# EAGLE design BPMLabLineRX (EAGLE 7.5.0)
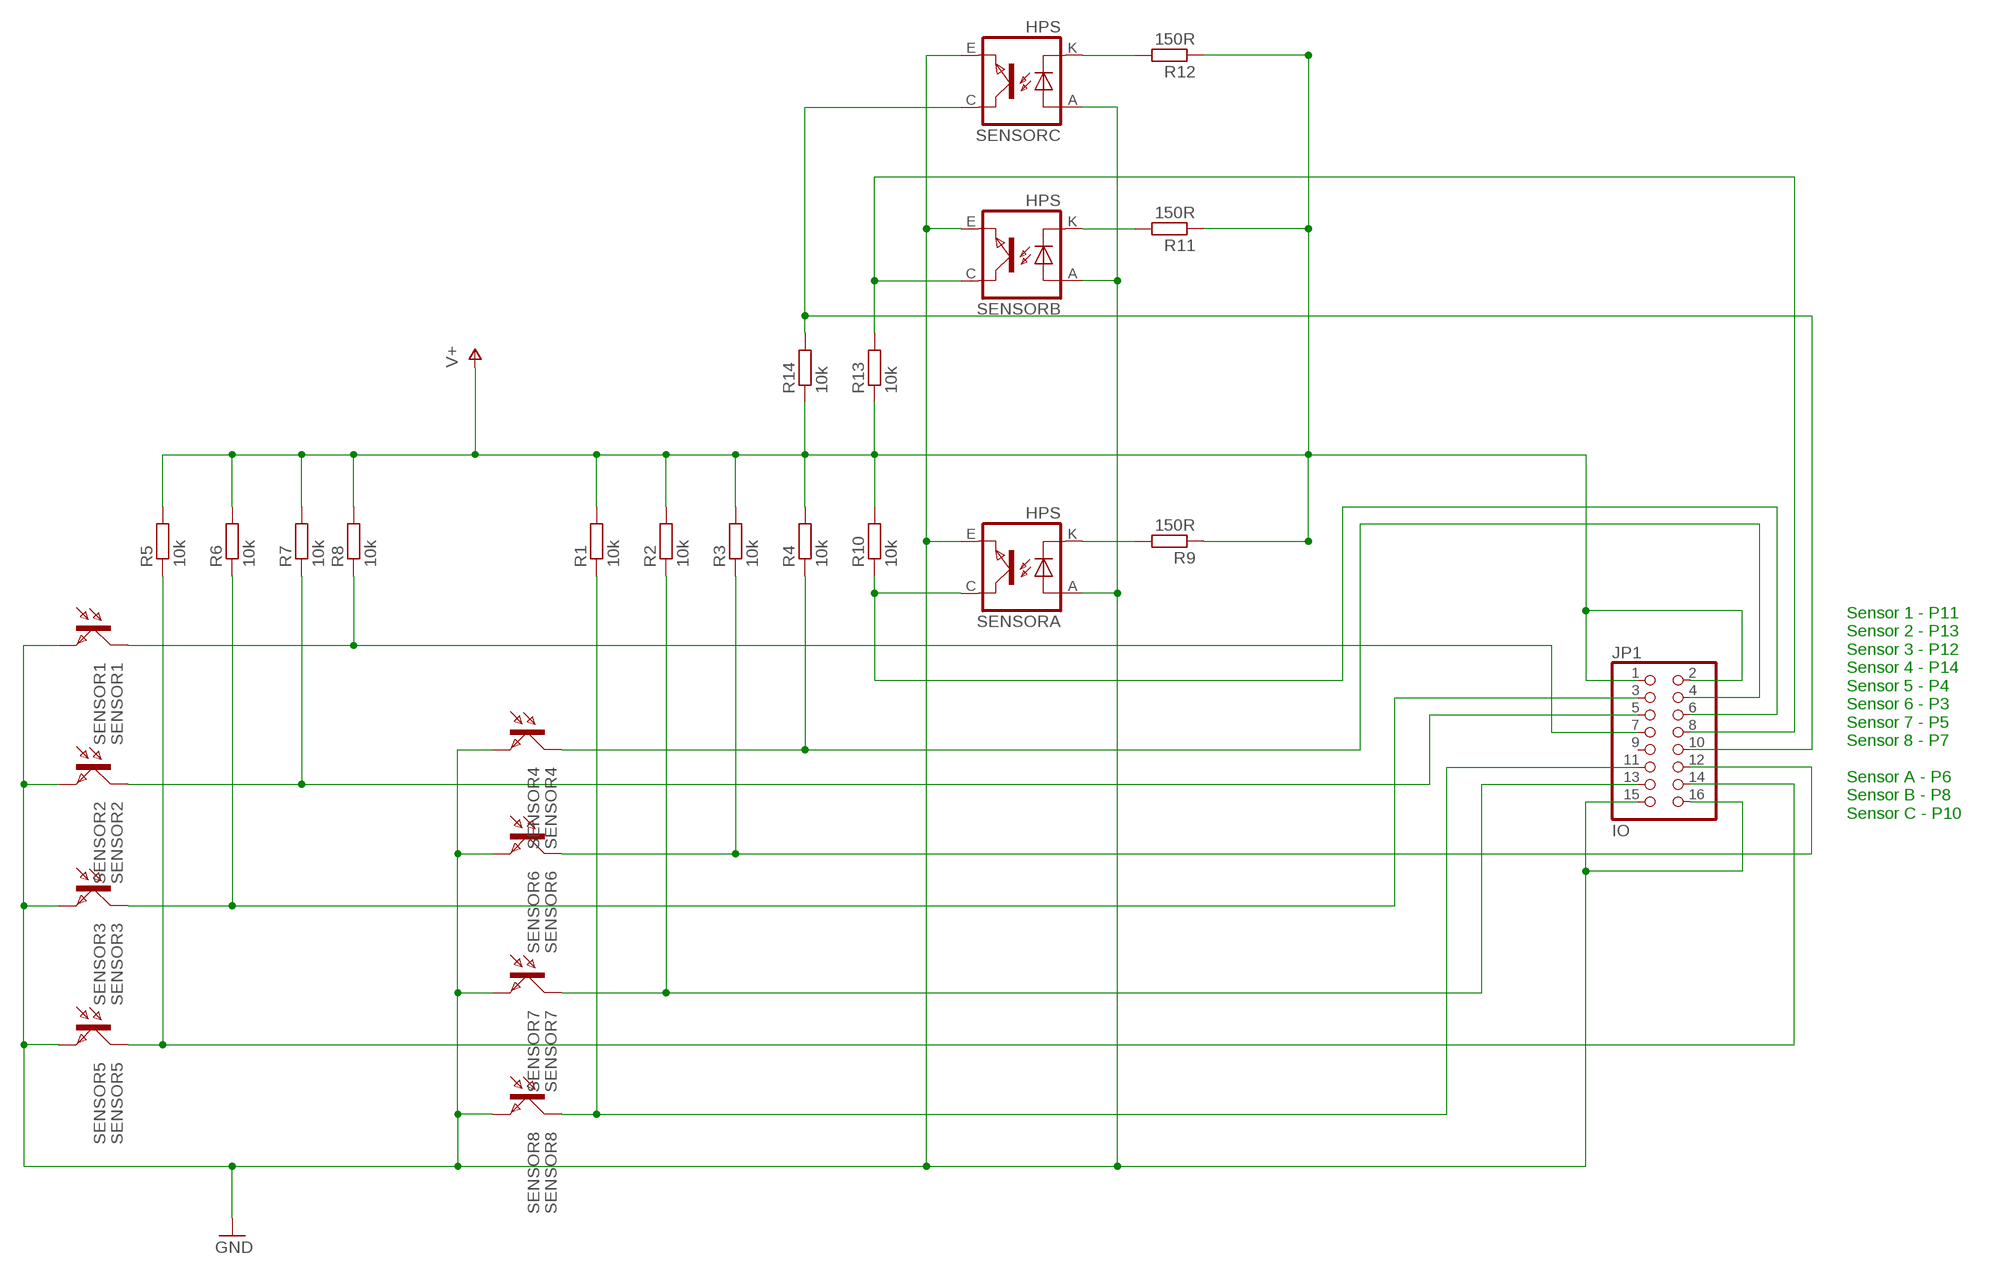
[diagram p0: schematic, sheet 1]

## Parts
JP1  IO  PINHD-2X8  [2X08]
R1  10k  R-EU_M0805  [M0805]
R2  10k  R-EU_M0805  [M0805]
R3  10k  R-EU_M0805  [M0805]
R4  10k  R-EU_M0805  [M0805]
R5  10k  R-EU_M0805  [M0805]
R6  10k  R-EU_M0805  [M0805]
R7  10k  R-EU_M0805  [M0805]
R8  10k  R-EU_M0805  [M0805]
R9  150R  R-EU_M0805  [M0805]
R10  10k  R-EU_M0805  [M0805]
R11  150R  R-EU_M0805  [M0805]
R12  150R  R-EU_M0805  [M0805]
R13  10k  R-EU_M0805  [M0805]
R14  10k  R-EU_M0805  [M0805]
SENSOR1  SENSOR1  BPX81  [BPX81]
SENSOR2  SENSOR2  BPX81  [BPX81]
SENSOR3  SENSOR3  BPX81  [BPX81]
SENSOR4  SENSOR4  BPX81  [BPX81]
SENSOR5  SENSOR5  BPX81  [BPX81]
SENSOR6  SENSOR6  BPX81  [BPX81]
SENSOR7  SENSOR7  BPX81  [BPX81]
SENSOR8  SENSOR8  BPX81  [BPX81]
SENSORA  HPS  TCRT5000  [TCRT5000]
SENSORB  HPS  TCRT5000  [TCRT5000]
SENSORC  HPS  TCRT5000  [TCRT5000]

## Nets
GND: JP1.15 JP1.16 SENSOR1.E SENSOR2.E SENSOR3.E SENSOR4.E SENSOR5.E SENSOR6.E SENSOR7.E SENSOR8.E SENSORA.A(ANODE) SENSORA.E(EMITTER) SENSORB.A(ANODE) SENSORB.E(EMITTER) SENSORC.A(ANODE) SENSORC.E(EMITTER)
N$1: JP1.4 R4.1 SENSOR4.C
N$2: JP1.12 R3.1 SENSOR6.C
N$3: JP1.13 R2.1 SENSOR7.C
N$4: JP1.11 R1.1 SENSOR8.C
N$5: JP1.7 R8.1 SENSOR1.C
N$6: JP1.5 R7.1 SENSOR2.C
N$7: JP1.3 R6.1 SENSOR3.C
N$8: JP1.14 R5.1 SENSOR5.C
N$9: JP1.6 R10.1 SENSORA.C(COLLECTOR)
N$10: R9.2 SENSORA.K(CATHODE)
N$12: R12.2 SENSORC.K(CATHODE)
N$13: R11.2 SENSORB.K(CATHODE)
N$16: JP1.8 R13.2 SENSORB.C(COLLECTOR)
N$17: JP1.10 R14.2 SENSORC.C(COLLECTOR)
V+: JP1.1 JP1.2 R1.2 R2.2 R3.2 R4.2 R5.2 R6.2 R7.2 R8.2 R9.1 R10.2 R11.1 R12.1 R13.1 R14.1
Unconnected: JP1.9

## Notes on the sheet
- Sensor 1 - P11
  Sensor 2 - P13
  Sensor 3 - P12
  Sensor 4 - P14
  Sensor 5 - P4
  Sensor 6 - P3
  Sensor 7 - P5
  Sensor 8 - P7
  
  Sensor A - P6
  Sensor B - P8
  Sensor C - P10

## Library data of the parts
JP1 = pinhead:PINHD-2X8: PIN HEADER
R1-R14 = resistor:R-EU_: RESISTOR, European symbol
SENSOR1-SENSOR8 = opto-trans-siemens:BPX81: PHOTO TRANSISTOR; OC_FARNELL: unknown; OC_NEWARK: unknown
SENSORA SENSORB SENSORC = tcrt5000:TCRT5000

## Board
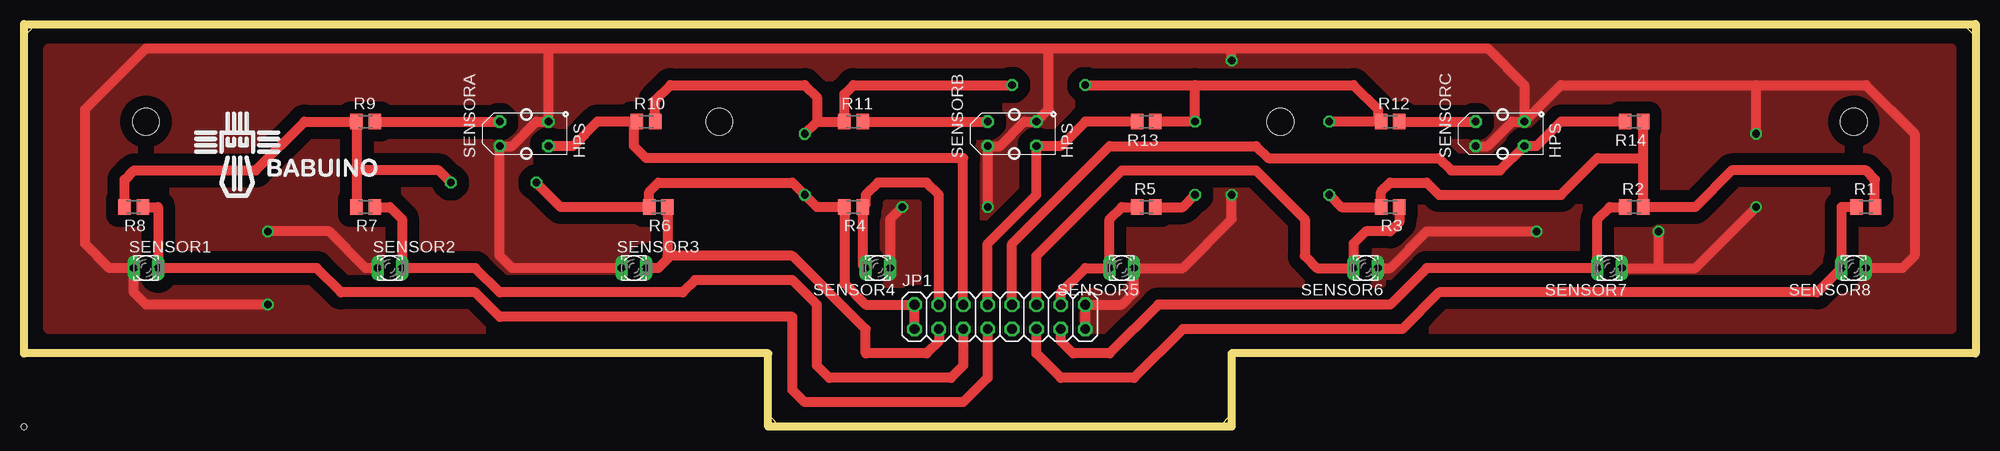
[diagram p1: board, top side]
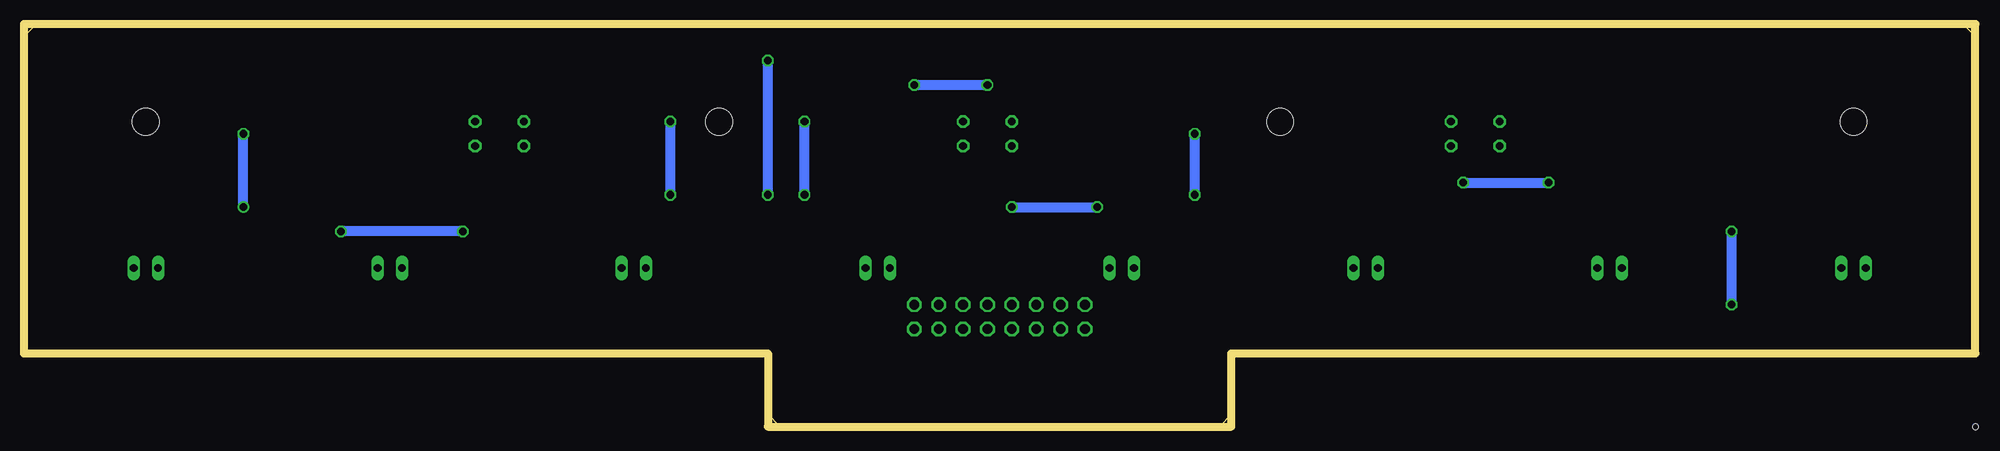
[diagram p2: board, bottom side, seen from below]

Size 203.18 x 41.91 mm. Coordinates in mm from the lower left corner, seen from the top.
Outline: 0,7.62 77.47,7.62 77.47,1.27 78.74,0 124.46,0 125.73,1.27 125.73,7.62 203.18,7.62 203.18,40.66 201.93,41.91 1.27,41.91 0,40.64 0,7.62
Copper layers (1*16): Top 0.035mm / dielectric 1.5mm / Bottom 0.035mm
Design rules "default *": minimum track width 40mil, minimum drill 30mil, track to track 8mil, track to pad 8mil, pad to pad 8mil, via to via 8mil, smd to smd 8mil, copper to edge 40mil, drill to drill 8mil, minimum pad ring 10mil, minimum via ring 8mil, stop-mask expansion 4mil, vias tented up to drill 0mil, thermal gap 0mil
Holes 2.8 mm at 72.39,31.75 130.81,31.75 190.5,31.75 12.7,31.75
Holes 0.6 mm at 0,0 125.73,0 77.47,0 0,41.91 203.2,41.91
Milling: 8 lines

### Footprints (pad centres in the part's own frame; a part is rotated, then mirrored left to right if it is on the bottom)
2X08 = drill 1.016 octagon: 1 -8.89,-1.27; 2 -8.89,1.27; 3 -6.35,-1.27; 4 -6.35,1.27; 5 -3.81,-1.27; 6 -3.81,1.27; 7 -1.27,-1.27; 8 -1.27,1.27; 9 1.27,-1.27; 10 1.27,1.27; 11 3.81,-1.27; 12 3.81,1.27; 13 6.35,-1.27; 14 6.35,1.27; 15 8.89,-1.27; 16 8.89,1.27
M0805 = smd 1.3 x 1.6: 1 -0.95,0; 2 0.95,0
BPX81 = drill 0.813 long: C 1.27,0; E -1.27,0
TCRT5000 = drill 0.8 octagon: A -2.54,-1.27; C 2.54,-1.27; E 2.54,1.27; K -2.54,1.27

### Placement (x,y rotation side)
JP1  101.6,11.43 0 top
R1  191.77,22.86 0 top
R2  167.64,22.86 0 top
R3  142.24,22.86 180 top
R4  86.36,22.86 180 top
R5  116.84,22.86 0 top
R6  66.04,22.86 180 top
R7  35.56,22.86 180 top
R8  11.43,22.86 180 top
R9  35.56,31.75 0 top
R10  64.77,31.75 0 top
R11  86.36,31.75 0 top
R12  142.24,31.75 0 top
R13  116.84,31.75 180 top
R14  167.64,31.75 180 top
SENSOR1  12.7,16.51 0 top
SENSOR2  38.1,16.51 0 top
SENSOR3  63.5,16.51 0 top
SENSOR4  88.9,16.51 180 top
SENSOR5  114.3,16.51 180 top
SENSOR6  139.7,16.51 180 top
SENSOR7  165.1,16.51 180 top
SENSOR8  190.5,16.51 180 top
SENSORA  52.07,30.48 0 top
SENSORB  102.87,30.48 0 top
SENSORC  153.67,30.48 0 top

### Tracks (layer width: path | path; a pad name or v marks a point on that pad's centre or on a via)
GND  (via drill 0.8)
  Top 1.016: SENSORC.A 152.4,29.21 154.94,31.75 SENSORC.E | JP1.15 JP1.16 114.3,12.7 115.57,13.97 SENSOR5.E 120.65,16.51 125.73,21.59 v125.73,24.13 | SENSORC.E 160.02,35.56 180.34,35.56 | 180.34,35.56 191.77,35.56 196.85,30.48 196.85,17.78 195.58,16.51 SENSOR8.E | SENSOR7.E 170.18,16.51 | 170.18,16.51 173.99,16.51 v180.34,22.86 | v180.34,30.48 180.34,35.56 | SENSOR6.E 142.24,16.51 146.05,20.32 v157.48,20.32 | v170.18,20.32 170.18,16.51 | 106.68,39.37 106.68,33.02 SENSORB.E 104.14,31.75 101.6,29.21 SENSORB.A v100.33,22.86 | 106.68,39.37 125.73,39.37 | v125.73,38.1 125.73,39.37 | 125.73,39.37 152.4,39.37 156.21,35.56 SENSORC.E | v91.44,22.86 90.17,21.59 SENSOR4.E | 54.61,39.37 SENSORA.E 53.34,31.75 50.8,29.21 SENSORA.A 49.53,17.78 50.8,16.51 SENSOR3.E | 54.61,39.37 106.68,39.37 | 54.61,39.37 12.7,39.37 6.35,33.02 6.35,19.05 8.89,16.51 SENSOR1.E 11.43,13.97 12.7,12.7 v25.4,12.7 | SENSOR2.E 35.56,16.51 31.75,20.32 v25.4,20.32
  Bottom 1.016: v180.34,22.86 v180.34,30.48 | v157.48,20.32 v170.18,20.32 | v100.33,22.86 v91.44,22.86 | v25.4,20.32 v25.4,12.7 | v125.73,24.13 v125.73,38.1
  pour Top (isolate 1.27): 2.54,39.37 200.66,39.37 200.66,10.16 2.54,10.16
N$1
  Top 1.016: SENSOR4.C 87.31,16.83 R4.1 87.63,23.18 87.63,24.13 88.9,25.4 93.98,25.4 95.25,24.13 JP1.4
N$2
  Top 1.016: JP1.12 105.41,17.78 114.3,26.67 128.27,26.67 133.35,21.59 133.35,17.78 134.62,16.51 SENSOR6.C 138.43,19.05 139.7,20.32 142.24,20.32 143.19,21.27 R3.1
N$3
  Top 1.016: JP1.13 107.95,8.89 109.22,7.62 113.03,7.62 118.11,12.7 142.24,12.7 146.05,16.51 SENSOR7.C 163.83,21.59 165.1,22.86 R2.1
N$4
  Top 1.016: JP1.11 105.41,7.62 107.95,5.08 115.57,5.08 120.65,10.16 143.51,10.16 147.32,13.97 186.69,13.97 SENSOR8.C 189.23,22.86 R1.1
N$5
  Top 1.016: R8.1 13.97,22.86 SENSOR1.C 30.48,16.51 33.02,13.97 46.99,13.97 49.53,11.43 80.01,11.43 80.01,3.81 81.28,2.54 97.79,2.54 100.33,5.08 JP1.7
N$6
  Top 1.016: R7.1 38.1,22.86 39.37,21.59 SENSOR2.C 46.99,16.51 49.53,13.97 68.58,13.97 69.85,15.24 80.01,15.24 82.55,12.7 82.55,6.35 83.82,5.08 96.52,5.08 97.79,6.35 JP1.5
N$7
  Top 1.016: R6.1 66.99,17.78 | 66.99,17.78 66.99,17.46 66.04,16.51 SENSOR3.C | JP1.3 95.25,8.89 93.98,7.62 87.63,7.62 87.63,10.16 80.01,17.78 66.99,17.78
N$8
  Top 1.016: JP1.14 107.95,13.97 110.49,16.51 SENSOR5.C 113.03,21.59 114.3,22.86 R5.1
N$9
  Top 1.016: SENSORA.C 57.15,29.21 59.69,31.75 R10.1 63.5,31.43 63.5,29.21 64.77,27.94 97.79,27.94 JP1.6
N$10
  Top 1.016: R9.2 SENSORA.K
N$12
  Top 1.016: R12.2 SENSORC.K
N$13
  Top 1.016: R11.2 SENSORB.K
N$16
  Top 1.016: R13.2 110.49,31.75 107.95,29.21 SENSORB.C 105.41,24.13 100.33,19.05 JP1.8
N$17
  Top 1.016: R14.2 160.02,31.75 157.48,29.21 SENSORC.C 153.67,26.67 148.59,26.67 147.32,27.94 129.54,27.94 128.27,29.21 113.03,29.21 102.87,19.05 JP1.10
V+  (via drill 0.8)
  Top 1.016: JP1.1 JP1.2 87.63,12.7 85.41,14.92 R4.2 82.55,22.86 v81.28,24.13 80.01,25.4 66.04,25.4 65.09,24.45 R6.2 55.88,22.86 v53.34,25.4 | R1.2 192.72,25.72 191.77,26.67 177.8,26.67 173.99,22.86 R2.2 168.59,27.94 | 168.59,27.94 R14.1 | 168.59,27.94 163.83,27.94 160.02,24.13 147.32,24.13 146.05,25.4 142.24,25.4 141.29,24.45 R3.2 137.16,22.86 v135.89,24.13 | R5.2 120.65,22.86 v121.92,24.13 | R13.1 v121.92,31.75 121.92,35.56 | 121.92,35.56 138.43,35.56 140.97,33.02 140.97,32.07 R12.1 v135.89,31.75 | v81.28,30.48 82.55,31.75 | 82.55,31.75 R11.1 85.41,34.61 86.36,35.56 v102.87,35.56 | R10.2 65.72,33.97 67.31,35.56 81.28,35.56 82.55,34.29 82.55,31.75 | R8.2 10.48,25.72 11.43,26.67 24.13,26.67 29.21,31.75 R9.1 34.61,26.67 | 34.61,26.67 R7.2 | v44.45,25.4 43.18,26.67 34.61,26.67 | v110.49,35.56 121.92,35.56
  Bottom 1.016: v121.92,24.13 v121.92,31.75 | v135.89,31.75 v135.89,24.13 | v81.28,24.13 v81.28,30.48 | v53.34,25.4 v44.45,25.4 | v102.87,35.56 v110.49,35.56